# Altium schematic sheet Плата 348.SchDoc
size 209 x 297 mm; SheetNumber: 4; SheetTotal: 5
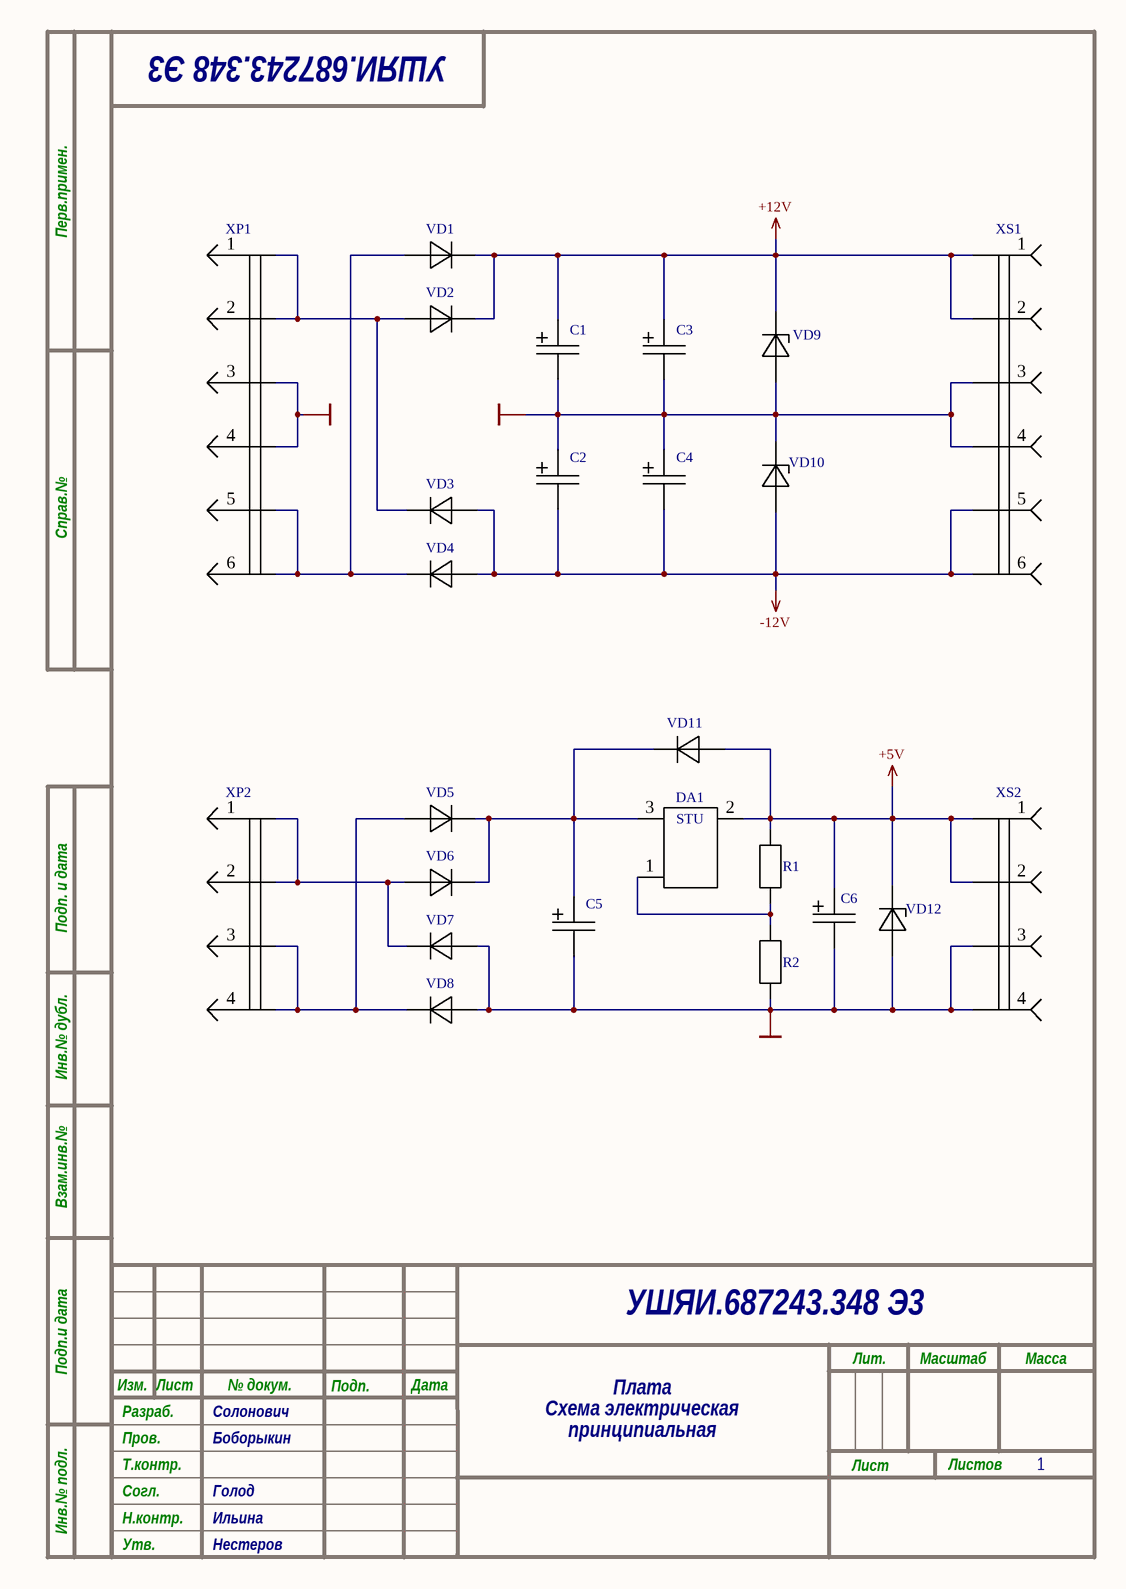
[diagram p0: Плата 348.SchDoc]

## Parts
C1  Полярный конденсатор  (value not drawn)
C2  Полярный конденсатор  (value not drawn)
C3  Полярный конденсатор  (value not drawn)
C4  Полярный конденсатор  (value not drawn)
C5  Полярный конденсатор  (value not drawn)
C6  Полярный конденсатор  (value not drawn)
DA1  Микросхема  (value not drawn)
R1  Резистор мини  (value not drawn)
R2  Резистор мини  (value not drawn)
VD1  Диод  (value not drawn)
VD2  Диод  (value not drawn)
VD3  Диод  (value not drawn)
VD4  Диод  (value not drawn)
VD5  Диод  (value not drawn)
VD6  Диод  (value not drawn)
VD7  Диод  (value not drawn)
VD8  Диод  (value not drawn)
VD9  Стабилитрон  (value not drawn)
VD10  Стабилитрон  (value not drawn)
VD11  Диод  (value not drawn)
VD12  Стабилитрон  (value not drawn)
XP1  Вилка 6 пин  (value not drawn)
XP2  Вилка 4 пин  (value not drawn)
XS1  Розетка 6 пин  (value not drawn)
XS2  Розетка 4 пин  (value not drawn)

## Nets
+5V: C6.1 DA1.2 R1.2 VD11.2 VD12.1 XS2.1 XS2.2
+12V: C1.1 C3.1 VD1.1 VD2.1 VD9.1 XS1.1 XS1.2
-12V: C2.2 C4.2 VD3.2 VD4.2 VD10.2 XS1.5 XS1.6
GND: C1.2 C2.1 C3.2 C4.1 C5.2 C6.2 R2.1 VD7.2 VD8.2 VD9.2 VD10.1 VD12.2 XP1.3 XP1.4 XS1.3 XS1.4 XS2.3 XS2.4
NetC5_1: C5.1 DA1.3 VD5.1 VD6.1 VD11.1
NetDA1_1: DA1.1 R1.1 R2.2
NetVD1_2: VD1.2 VD4.1 XP1.5 XP1.6
NetVD2_2: VD2.2 VD3.1 XP1.1 XP1.2
NetVD5_2: VD5.2 VD8.1 XP2.3 XP2.4
NetVD6_2: VD6.2 VD7.1 XP2.1 XP2.2

## Notes on the sheet
- УШЯИ.687243.348 Э3
- Солонович
- Плата
- Схема электрическая
- Боборыкин
- принципиальная
- 1
- Голод
- Нестеров
- Ильина
- Перв.примен.
- Справ.№
- Подп. и дата
- Инв.№ дубл.
- Взам.инв.№
- Подп.и дата
- Разраб.
- Изм.
- Лист
- № докум.
- Подп.
- Дата
- Лит.
- Масштаб
- Масса
- Т.контр.
- Пров.
- Листов
- Инв.№ подл.
- Утв.
- Н.контр.
- Согл.
- (in symbol Микросхема) STU